# EAGLE design CanSat gpskortuten jtag (EAGLE 5.05)
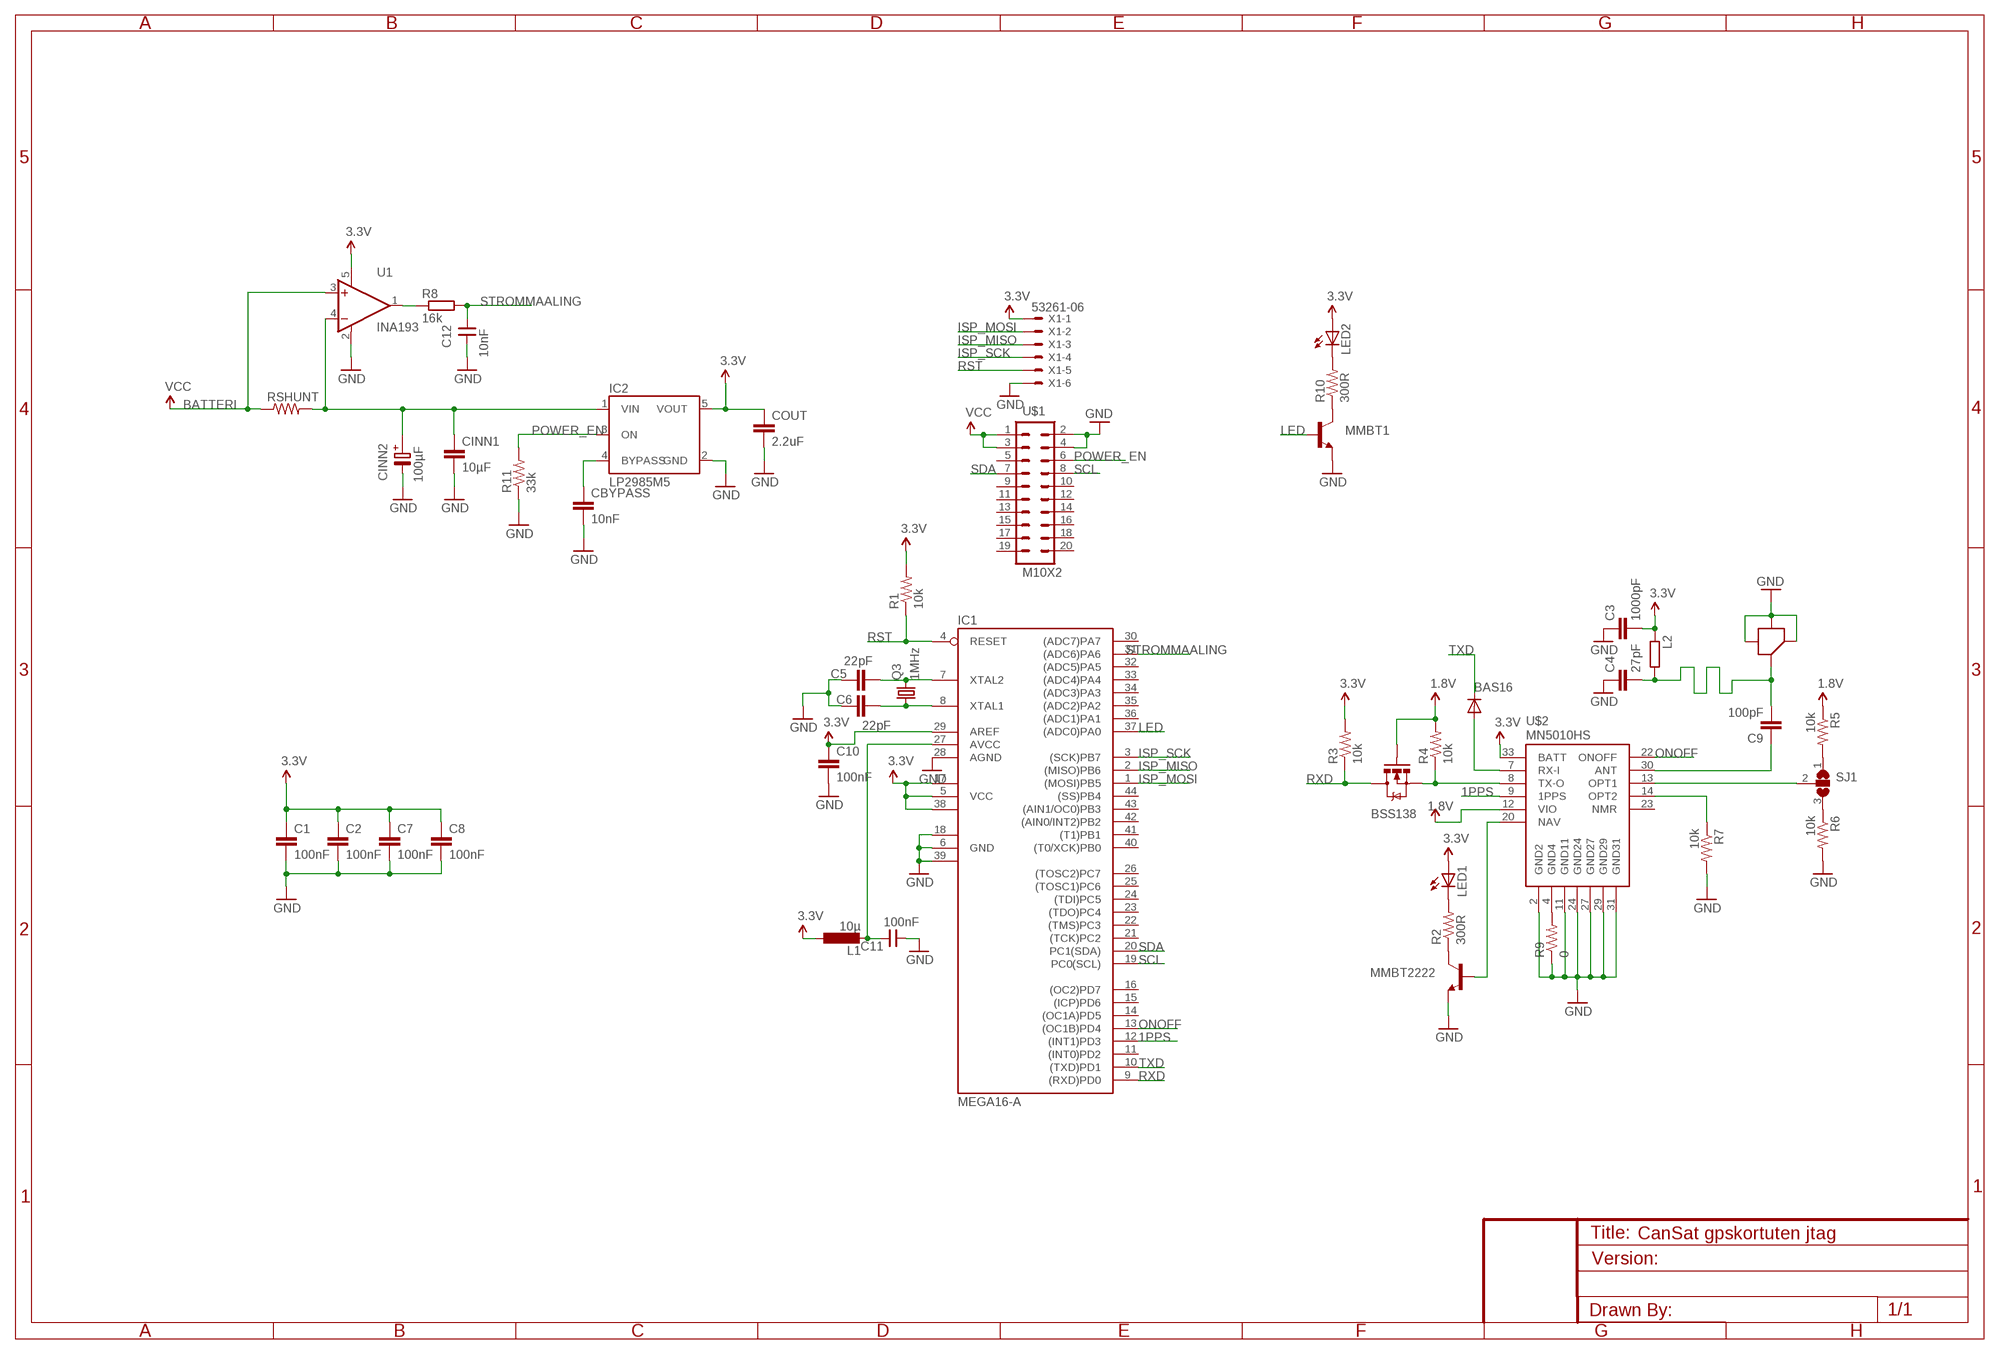
[diagram p0: schematic, sheet 1]

## Parts
BAS16  DIODESOT23  [SOT23-3]
BSS138  MOSFET-NCHANNELSMD  [SOT23-3]
C1  100nF  CAP0805  [0805]
C2  100nF  CAP0805  [0805]
C3  1000pF  C-EUC0402  [C0402]
C4  27pF  C-EUC0402  [C0402]
C5  22pF  CAP0805  [0805]
C6  22pF  CAP0805  [0805]
C7  100nF  CAP0805  [0805]
C8  100nF  CAP0805  [0805]
C9  100pF  C-EUC0603  [C0603]
C10  100nF  CAP0805  [0805]
C11  100nF  CNP-0805  [0805]
C12  10nF  CNP-0805  [0805]
CBYPASS  10nF  CAP0805  [0805]
CINN1  10µF  CAP0805  [0805]
CINN2  100µF  C-PR-SMD-SV-C  [SV-C]
COUT  2.2uF  CAP0805  [0805]
IC1  MEGA16-A  [TQFP44]
IC2  LP2985M5  [SOT23-5]
L1  10µ  L-EUL0805  [L0805]
L2  R-EU_R0603  [R0603]
LED1  LEDCHIPLED_0805  [CHIPLED_0805]
LED2  LEDCHIPLED_0805  [CHIPLED_0805]
MMBT1  TRANSISTOR_NPNSOT23  [SOT23]
MMBT2222  TRANSISTOR_NPNSOT23  [SOT23]
Q3  1MHz  CRYSTALSMD  [HC49UP]
R1  10k  RESISTOR  [0805]
R2  300R  RESISTOR  [0805]
R3  10k  RESISTOR  [0805]
R4  10k  RESISTOR  [0805]
R5  10k  RESISTOR  [0805]
R6  10k  RESISTOR  [0805]
R7  10k  RESISTOR  [0805]
R8  16k  R-EU_R0805  [R0805]
R9  0  RESISTOR  [0805]
R10  300R  RESISTOR  [0805]
R11  33k  RESISTOR  [0805]
RSHUNT  RESISTOR1206  [1206]
SJ1  SOLDERJUMPER_2WAYT  [SJ_2]
U1  INA193  [SOT23-5]
U$1  M10X2  [2X10]
U$2  MN5010HS  [GR-10]
U$3  H.FL_CON  [HFL_FP]
X1  53261-06  [53261-06]

## Nets
1.8V: BSS138.1(G) R4.2 R5.1 U$2.12(VIO)
1PPS: IC1.12((INT1)PD3) U$2.9(1PPS)
3.3V: C1.1 C2.1 C3.2 C7.1 C8.1 C10.1 COUT.1 IC1.5(VCC) IC1.17(VCC1) IC1.29(AREF) IC1.38(VCC2) IC2.5(VOUT) L1.1 L2.1 LED1.A LED2.A R1.2 R3.2 U1.5(V+) U$2.33(BATT) X1.1
ANTENNE: C4.2 C9.2 L2.2 U$3.MIDDLE(SIG)
AVCC: C11.2 IC1.27(AVCC) L1.2
BATTERI: RSHUNT.1 U1.3(VIN+) U$1.1 U$1.3 ; supply symbol labelled VCC
GND: C1.2 C2.2 C3.1 C4.1 C5.1 C6.2 C7.2 C8.2 C10.2 C11.1 C12.1 CBYPASS.2 CINN1.2 CINN2.- COUT.2 IC1.6(GND) IC1.18(GND1) IC1.28(AGND) IC1.39(GND2) IC2.2(GND) MMBT1.2(E) MMBT2222.2(E) R6.2 R7.2 R9.1 R11.1 U1.2(GND) U$1.2 U$1.4 U$2.2(GND2) U$2.11(GND11) U$2.24(GND24) U$2.27(GND27) U$2.29(GND29) U$2.31(GND31) U$3.GND_BOTTOM(GND_B) U$3.GND_LEFT(GND_L) U$3.GND_RIGHT(GND_R) X1.6
ISP_MISO: IC1.2((MISO)PB6) X1.3
ISP_MOSI: IC1.1((MOSI)PB5) X1.2
ISP_SCK: IC1.3((SCK)PB7) X1.4
LED: IC1.37((ADC0)PA0) MMBT1.1(B)
N$2: R5.2 SJ1.1
N$3: R6.1 SJ1.3
N$4: R8.1 U1.1(OUT)
N$5: C9.1 U$2.30(ANT)
N$6: SJ1.2 U$2.13(OPT1)
N$7: R7.1 U$2.14(OPT2)
N$9: BSS138.2(S) R4.1 U$2.8(TX-O)
N$10: C5.2 IC1.7(XTAL2) Q3.2
N$11: C6.1 IC1.8(XTAL1) Q3.1
N$12: LED1.C R2.2
N$13: MMBT2222.3(C) R2.1
N$14: MMBT2222.1(B) U$2.20(NAV)
N$15: R9.2 U$2.4(GND4)
N$16: LED2.C R10.2
N$17: BAS16.1(A) U$2.7(RX-I)
N$18: MMBT1.3(C) R10.1
N$20: CINN1.1 CINN2.+ IC2.1(VIN) RSHUNT.2 U1.4(VIN-)
N$22: CBYPASS.1 IC2.4(BYPASS)
ONOFF: IC1.13((OC1B)PD4) U$2.22(ONOFF)
POWER_EN: IC2.3(ON) R11.2 U$1.6
RST: IC1.4(RESET) R1.1 X1.5
RXD: BSS138.3(D) IC1.9((RXD)PD0) R3.1
SCL: IC1.19(PC0(SCL)) U$1.8
SDA: IC1.20(PC1(SDA)) U$1.7
STROMMAALING: C12.2 IC1.31((ADC6)PA6) R8.2
TXD: BAS16.3(C) IC1.10((TXD)PD1)
Unconnected: IC1.11((INT0)PD2) IC1.14((OC1A)PD5) IC1.15((ICP)PD6) IC1.16((OC2)PD7) IC1.21((TCK)PC2) IC1.22((TMS)PC3) IC1.23((TDO)PC4) IC1.24((TDI)PC5) IC1.25((TOSC1)PC6) IC1.26((TOSC2)PC7) IC1.30((ADC7)PA7) IC1.32((ADC5)PA5) IC1.33((ADC4)PA4) IC1.34((ADC3)PA3) IC1.35((ADC2)PA2) IC1.36((ADC1)PA1) IC1.40((T0/XCK)PB0) IC1.41((T1)PB1) IC1.42((AIN0/INT2)PB2) IC1.43((AIN1/OC0)PB3) IC1.44((SS)PB4) U$1.5 U$1.9 U$1.10 U$1.11 U$1.12 U$1.13 U$1.14 U$1.15 U$1.16 U$1.17 U$1.18 U$1.19 U$1.20 U$2.23(NMR)

## Library data of the parts
BAS16 = SparkFun:DIODE: Diode These are standard reverse protection diodes and small signal diodes. SMA package can handle up to about 1A. SOD-323 can handle about 200mA. What the SOD-323 package when ordering, there are some mfgs out there that are 5-pin packages.
BSS138 = SparkFun:MOSFET-NCHANNEL
C1 C2 C5-C8 C10 CBYPASS CINN1 COUT = SparkFun:CAP: Capacitor Standard 0603 ceramic capacitor, and 0.1" leaded capacitor.
C3 C4 C9 = resistor:C-EU: CAPACITOR, European symbol
C11 C12 = cap-master:CNP-: NON-POLARIZED CAP
CINN2 = cap-pan40:C-PR: POLARIZED ELECTROLYTIC/TANTALUM
IC1 = avr:MEGA16: MICROCONTROLLER 16 Kbytes FLASH 1 kbytes SRAM 512 bytes EEPROM USART 8-channel 10 bit ADC
IC2 = v-reg-3:LP2985: National Semiconductor <http://www.national.com> Micropower Linear Regulator 150mA regulated output, Vin 16V max., ultra-low dropout of 300mV @ 150mA, 1µA standby current, low noise
L1 = rcl-2:L-EU: INDUCTOR, European symbol
L2 R8 = resistor:R-EU_: RESISTOR, European symbol
LED1 LED2 = led:LED: LED OSRAM: - CHIPLED LG R971, LG N971, LY N971, LG Q971, LY Q971, LO R971, LY R971 LH N974, LH R974 LS Q976, LO Q976, LY Q976 LO Q996 - Hyper CHIPLED LW Q18S LB Q993, LB Q99A, LB R99A - SideLED LS A670, LO A670, LY A670, LG A670, LP A670 LB A673, LV A673, LT A673, LW A673 LH A674 LY A675 LS A676, LA A676, LO A676, LY A676, LW A676 LS A679, LY A679, LG A679 - Hyper Micro SIDELED® LS Y876, LA Y876, LO Y876, LY Y876 LT Y87S - SmartLED LW L88C, LW L88S LB L89C, LB L89S, LG L890 LS L89K, LO L89K, LY L89K LS L896, LA L896, LO L896, LY L896 - TOPLED LS T670, LO T670, LY T670, LG T670, LP T670 LSG T670, LSP T670, LSY T670, LOP T670, LYG T670 LG T671, LOG T671, LSG T671 LB T673, LV T673, LT T673, LW T673 LH T674 LS T676, LA T676, LO T676, LY T676, LB T676, LH T676, LSB T676, LW T676 LB T67C, LV T67C, LT T67C, LS T67K, LO T67K, LY T67K, LW E67C LS E67B, LA E67B, LO E67B, LY E67B, LB E67C, LV E67C, LT E67C LW T67C LS T679, LY T679, LG T679 LS T770, LO T770, LY T770, LG T770, LP T770 LB T773, LV T773, LT T773, LW T773 LH T774 LS E675, LA E675, LY E675, LS T675 LS T776, LA T776, LO T776, LY T776, LB T776 LHGB T686 LT T68C, LB T68C - Hyper Mini TOPLED® LB M676 - Mini TOPLED Santana® LG M470 LS M47K, LO M47K, LY M47K Source: http://www.osram.convergy.de LUXEON: - LUMILED® LXK2-PW12-R00, LXK2-PW12-S00, LXK2-PW14-U00, LXK2-PW14-V00 LXK2-PM12-R00, LXK2-PM12-S00, LXK2-PM14-U00 LXK2-PE12-Q00, LXK2-PE12-R00, LXK2-PE12-S00, LXK2-PE14-T00, LXK2-PE14-U00 LXK2-PB12-K00, LXK2-PB12-L00, LXK2-PB12-M00, LXK2-PB14-N00, LXK2-PB14-P00, LXK2-PB14-Q00 LXK2-PR12-L00, LXK2-PR12-M00, LXK2-PR14-Q00, LXK2-PR14-R00 LXK2-PD12-Q00, LXK2-PD12-R00, LXK2-PD12-S00 LXK2-PH12-R00, LXK2-PH12-S00 LXK2-PL12-P00, LXK2-PL12-Q00, LXK2-PL12-R00 Source: www.luxeon.com KINGBRIGHT: KA-3528ASYC Source: www.kingbright.com
MMBT1 MMBT2222 = SparkFun:TRANSISTOR_NPN: Transistor NPN BJT configuration in SOT23 package. MMBT2222 is the common NPN we use. Double check BCE configuration again layout.
Q3 = SparkFun:CRYSTAL: Crystals Various standard crystals. Proven footprints. Spark Fun Electronics SKU : COM-00534
R1-R7 R9-R11 RSHUNT = SparkFun:RESISTOR: Resistor Basic schematic elements and footprints for 0603, 1206, and PTH 1/10th watt (small) resistors.
SJ1 = SparkFun:SOLDERJUMPER_2WAY: Solder Jumper 2 way solder jumper
U1 = burr-brown:INA193
U$1 = SparkFun:M10X2: This was SPECIALLY designed to be used with our Graphic LCD Backpack. Be sure you want to use this! It is not only staggered on each line of header holes, but IT IS ALSO offset of the center point of the top and bottom lines by 5 mil. This causes the headers to lock into place on the "standard" footprint on the LCD screen. The extra squares on the tdocu layer are there simply to reference other pins (if you were to actually populate a longer header than ten long - this is what we do with the backpacks).
U$2 = SparkFun:MN5010HS: MN5010HS GPS Receiver Module. Packagse GR-10 and MN5010HS are NOT tested with this device.
U$3 = hfl:H.FL_CON
X1 = con-molex:53?-06: CONNECTOR wire to board 1.25 mm (.049 inch) pitch header

## Net classes
1 jord: clearance 0.6 mm

## Board
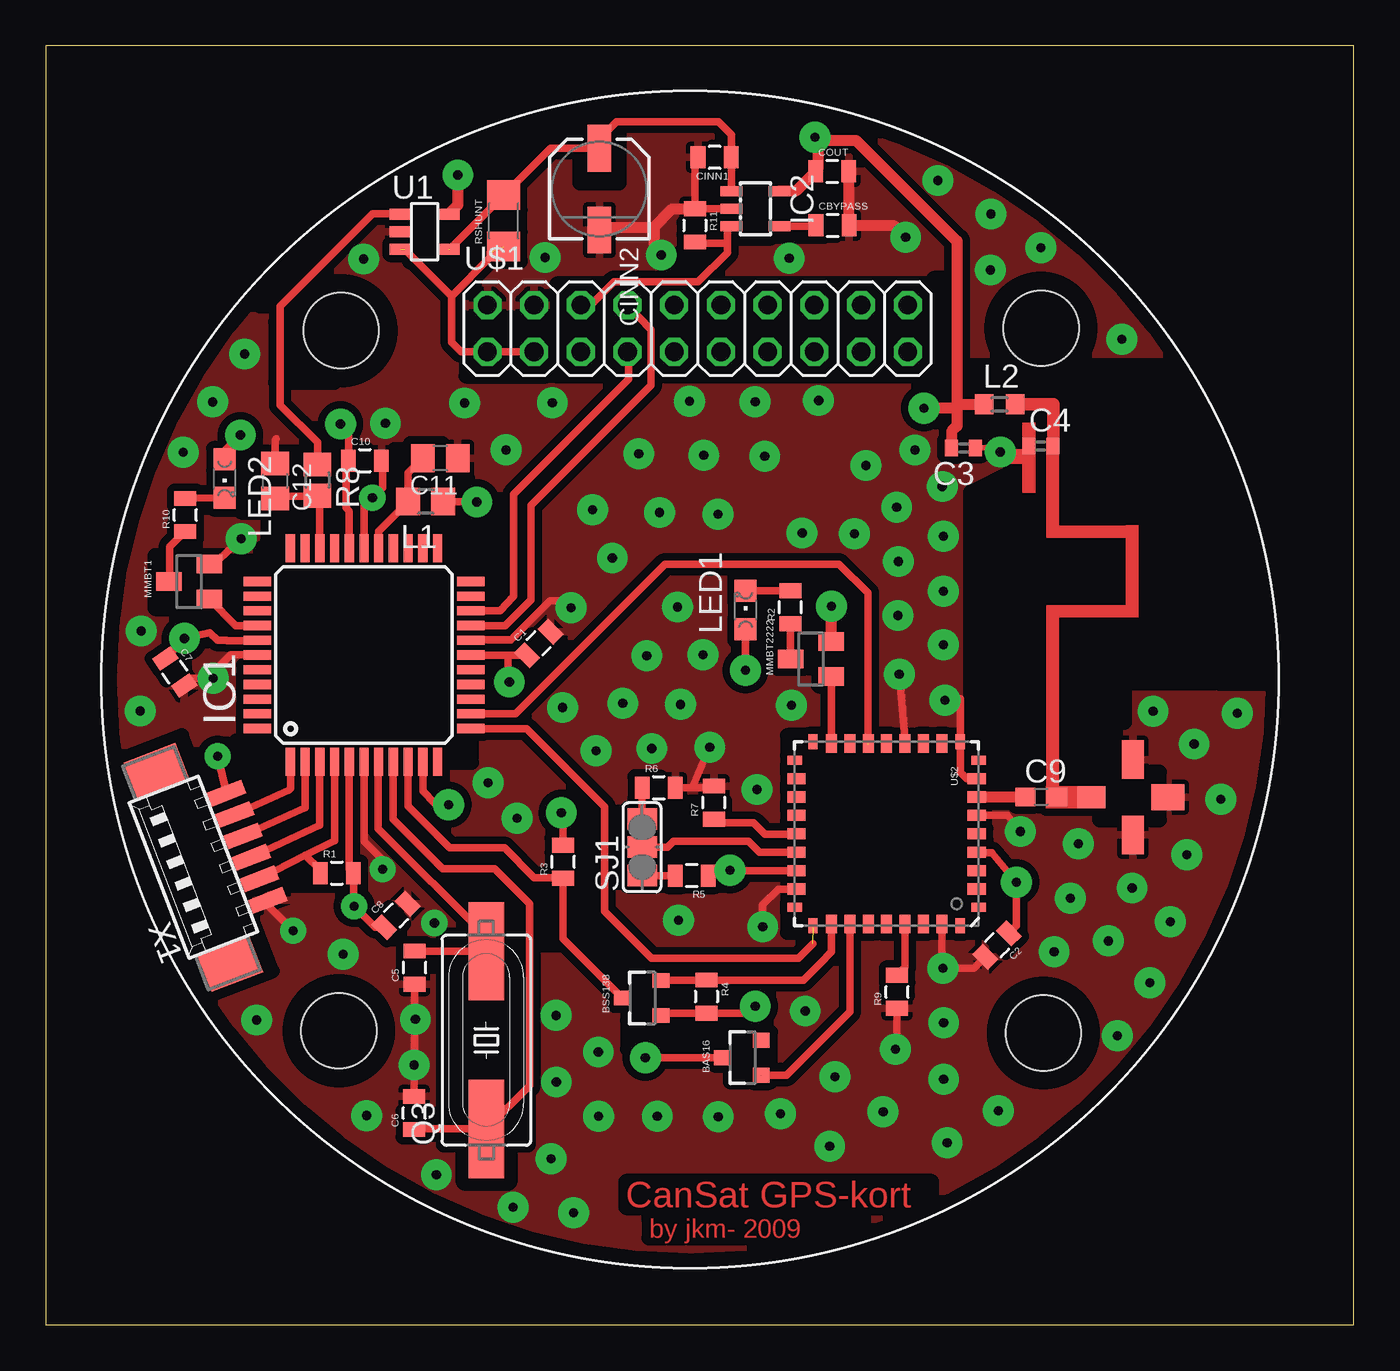
[diagram p1: board, top side]
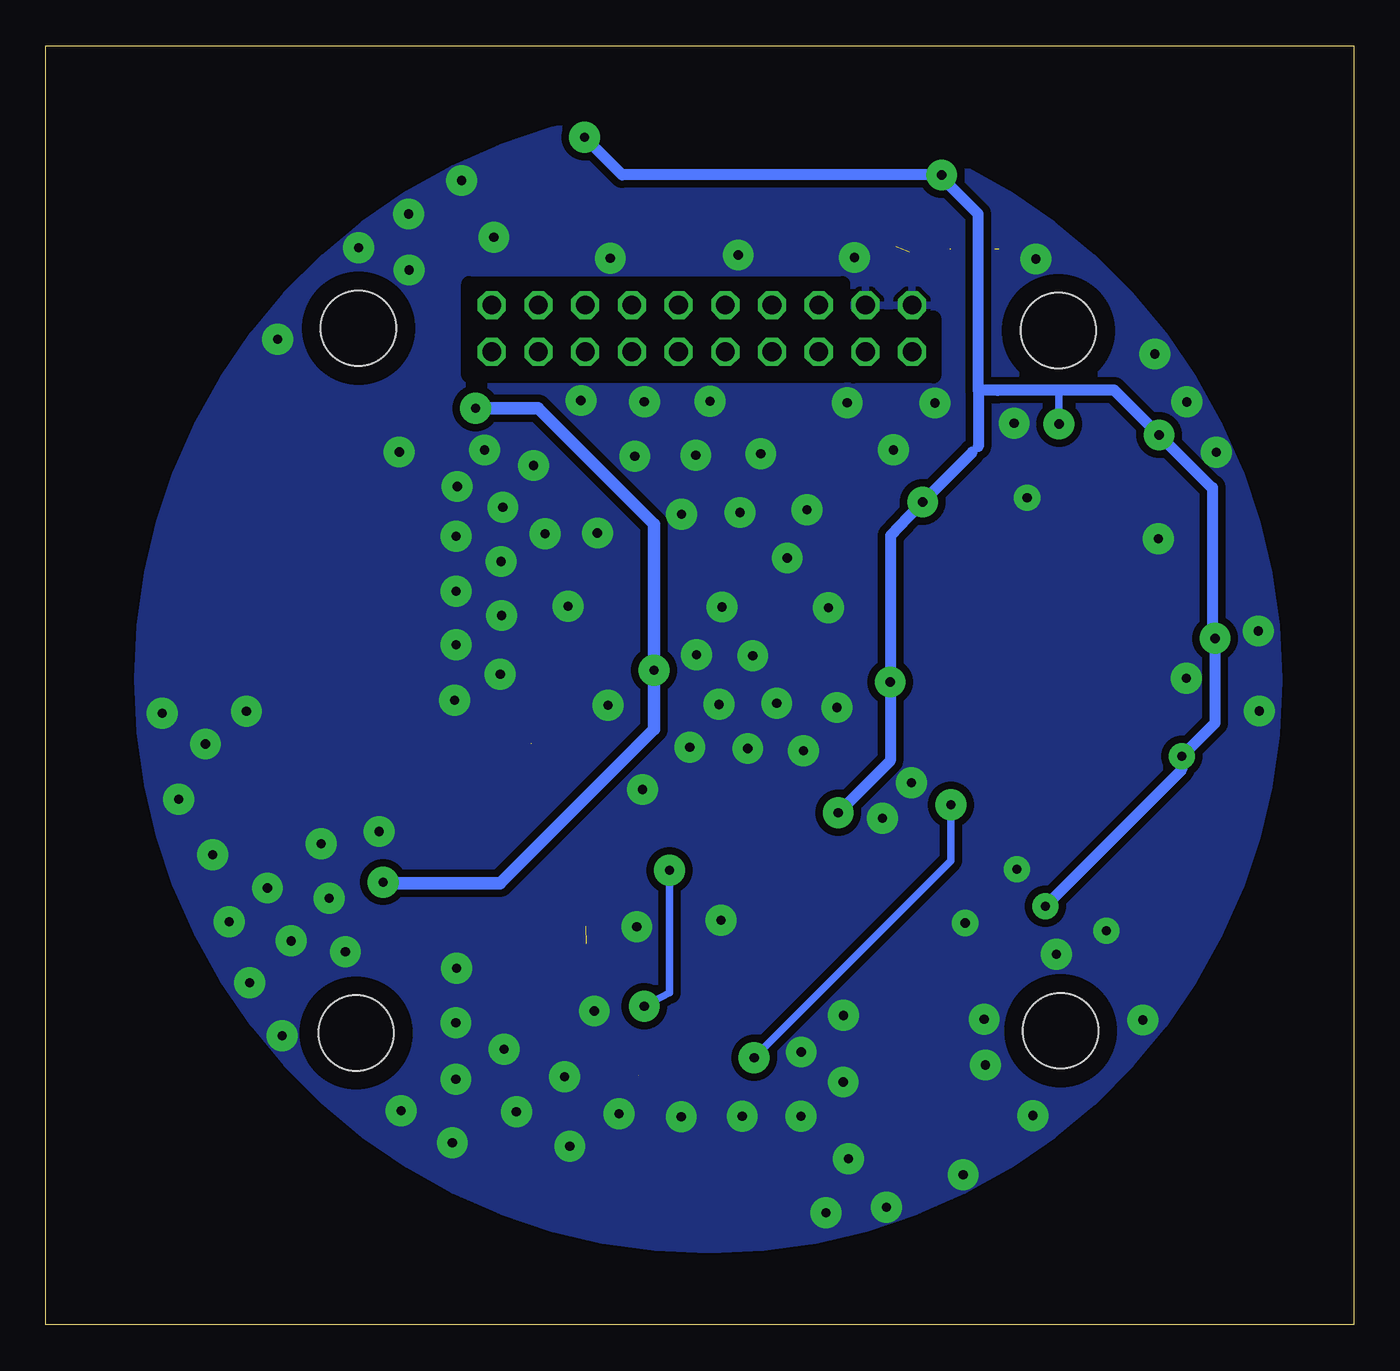
[diagram p2: board, bottom side, seen from below]

Size 71.1 x 69.51 mm. Coordinates in mm from the lower left corner, seen from the top.
Outline: 0,0 71.1,0 71.1,69.51 0,69.51 0,0
Copper layers (1*16): Top 0.035mm / dielectric 1.5mm / Bottom 0.035mm
Design rules "default *": minimum track width 10mil, minimum drill 24mil, track to track 12mil, track to pad 12mil, pad to pad 12mil, via to via 12mil, smd to smd 12mil, copper to edge 40mil, drill to drill 8mil, minimum pad ring 10mil, minimum via ring 8mil, stop-mask expansion 4mil, vias tented up to drill 0mil, thermal gap 10mil
tRestrict: area 35.7,27.1 to 36.9,28.5; area 32,28.6 to 33.4,29.8; area 33.8,23.9 to 36.4,25; area 31.7,16.3 to 34,19.2; area 33.4,26.6 to 35.6,28.4; area 45.7,17.9 to 46.8,19.4; area 37.2,13.2 to 39.4,15.9; area 41,36.4 to 42,37.8; area 42,34.7 to 43.4,36.3; area 21.6,9.8 to 26.2,21.2; area 19.4,10.2 to 20.6,11.6; area 19.4,19.3 to 20.6,20.7; 99 more areas; 35 lines
bRestrict: area 24.6,53.5 to 26.1,54.8; area 27.8,51.6 to 48.1,56.6; area 22.8,51.6 to 27.2,54.7

### Footprints (pad centres in the part's own frame; a part is rotated, then mirrored left to right if it is on the bottom)
SOT23-3 = smd 0.8 x 0.9: 1 -0.95,-1; 2 0.95,-1; 3 0,1.1
0805 = smd 0.8 x 1.2: 1 -0.9,0; 2 0.9,0
C0402 = smd 0.7 x 0.9: 1 -0.65,0; 2 0.65,0
C0603 = smd 1.1 x 1: 1 -0.85,0; 2 0.85,0
0805' = smd 1.27 x 1.524: 1 -0.953,0; 2 0.953,0
SV-C = smd 2.54 x 1.27: + -2.223,0; - 2.223,0
TQFP44 = smd 1.5 x 0.5: 1 -5.8,4; 2 -5.8,3.2; 3 -5.8,2.4; 4 -5.8,1.6; 5 -5.8,0.8; 6 -5.8,0; 7 -5.8,-0.8; 8 -5.8,-1.6; 9 -5.8,-2.4; 10 -5.8,-3.2; 11 -5.8,-4; 23 5.8,-4; 24 5.8,-3.2; 25 5.8,-2.4; 26 5.8,-1.6; 27 5.8,-0.8; 28 5.8,0; 29 5.8,0.8; 30 5.8,1.6; 31 5.8,2.4; 32 5.8,3.2; 33 5.8,4 | smd 0.5 x 1.5: 12 -4,-5.8; 13 -3.2,-5.8; 14 -2.4,-5.8; 15 -1.6,-5.8; 16 -0.8,-5.8; 17 0,-5.8; 18 0.8,-5.8; 19 1.6,-5.8; 20 2.4,-5.8; 21 3.2,-5.8; 22 4,-5.8; 34 4,5.8; 35 3.2,5.8; 36 2.4,5.8; 37 1.6,5.8; 38 0.8,5.8; 39 0,5.8; 40 -0.8,5.8; 41 -1.6,5.8; 42 -2.4,5.8; 43 -3.2,5.8; 44 -4,5.8
SOT23-5 = smd 0.55 x 1.2: 1 -0.95,-1.3; 2 0,-1.3; 3 0.95,-1.3; 4 0.95,1.3; 5 -0.95,1.3
L0805 = smd 1.3 x 1.5: 1 -0.95,0; 2 0.95,0
R0603 = smd 1 x 1.1: 1 -0.85,0; 2 0.85,0
CHIPLED_0805 = smd 1.2 x 1.2: A 0,-1.05; C 0,1.05
SOT23 = smd 1 x 1.4: 1 -0.95,-1.1; 2 0.95,-1.1; 3 0,1.1
HC49UP = smd 5.334 x 1.93: 1 -4.826,0; 2 4.826,0
R0805 = smd 1.3 x 1.5: 1 -0.85,0; 2 0.85,0
1206 = smd 1.6 x 1.8: 1 -1.4,0; 2 1.4,0
SJ_2 = smd 1.168 x 1.6: 1 -1.524,0; 2 0,0; 3 1.524,0
SOT23-5@1 = smd 0.6 x 1.2: 1 -0.95,-1.306; 2 0,-1.306; 3 0.95,-1.306; 4 0.95,1.306; 5 -0.95,1.306
2X10 = drill 1.016 octagon: 1 -11.013,-7.687; 2 -11.013,-5.147; 3 -8.473,-7.687; 4 -8.473,-5.147; 5 -5.933,-7.687; 6 -5.933,-5.147; 7 -3.393,-7.687; 8 -3.393,-5.147; 9 -0.853,-7.687; 10 -0.853,-5.147; 11 1.687,-7.687; 12 1.687,-5.147; 13 4.227,-7.687; 14 4.227,-5.147; 15 6.767,-7.687; 16 6.767,-5.147; 17 9.307,-7.687; 18 9.307,-5.147; 19 11.847,-7.687; 20 11.847,-5.147 | hole 4.1: 19.093,-6.407; 19.22,-44.715; -19.087,-44.591; -18.964,-6.533
GR-10 = smd 0.8 x 0.5: 1 5,4; 9 5,-4; 19 -5,-4; 27 -5,4 | smd 1 x 0.6: 2 4.9,3; 3 4.9,2; 4 4.9,1; 5 4.9,0; 6 4.9,-1; 7 4.9,-2; 8 4.9,-3; 20 -4.9,-3; 21 -4.9,-2; 22 -4.9,-1; 23 -4.9,0; 24 -4.9,1; 25 -4.9,2; 26 -4.9,3 | smd 0.5 x 0.8: 10 4,-5; 18 -4,-5; 28 -4,5; 36 4,5 | smd 0.6 x 1: 11 3,-4.9; 12 2,-4.9; 13 1,-4.9; 14 0,-4.9; 15 -1,-4.9; 16 -2,-4.9; 17 -3,-4.9; 29 -3,4.9; 30 -2,4.9; 31 -1,4.9; 32 0,4.9; 33 1,4.9; 34 2,4.9; 35 3,4.9
HFL_FP = smd 1.4 x 1.8: GND_BOTTOM 0,-1.9 | smd 2.1 x 1.2: GND_LEFT -2.05,0; GND_RIGHT 2.05,0 | smd 1.2 x 1.5: MIDDLE 0,2.25
53261-06 = smd 0.8 x 2: 1 3.125,-2.5; 2 1.875,-2.5; 3 0.625,-2.5; 4 -0.625,-2.5; 5 -1.875,-2.5; 6 -3.125,-2.5 | smd 2.1 x 3: S1 5.625,0.625; S2 -5.625,0.625

### Placement (x,y rotation side)
BAS16  37.88,14.52 90 top
BSS138  32.44,17.76 90 top
C1  26.79,37.04 45 top
C2  51.72,20.64 225 top
C3  49.89,47.66 180 top
C4  54.09,47.77 0 top
C5  20.04,19.41 90 top
C6  20.02,11.51 90 top
C7  7,35.49 305 top
C8  19.03,22.25 45 top
C9  54.1,28.7 0 top
C10  17.34,46.98 0 top
C11  100nF  [0805']  21.44,47.1 180 top
C12  10nF  [0805']  12.45,45.87 270 top
CBYPASS  42.77,59.76 0 top
CINN1  36.35,63.45 180 top
CINN2  30.09,61.73 270 top
COUT  42.75,62.69 0 top
IC1  17.29,36.41 90 top
IC2  38.57,60.67 270 top
L1  20.65,44.74 180 top
L2  51.85,50.03 0 top
LED1  38.04,38.85 0 top
LED2  9.72,46 180 top
MMBT1  7.79,40.4 90 top
MMBT2222  41.6,36.19 90 top
Q3  23.94,15.47 90 top
R1  15.81,24.55 0 top
R2  40.48,39 90 top
R3  28.12,25.17 90 top
R4  35.91,17.84 270 top
R5  35.11,24.42 180 top
R6  33.32,29.19 0 top
R7  36.31,28.39 90 top
R8  14.76,45.91 270 top
R9  46.27,18.1 90 top
R10  7.57,44.02 90 top
R11  35.28,59.76 270 top
RSHUNT  24.88,60 90 top
SJ1  32.41,25.96 90 top
U1  INA193  [SOT23-5@1]  20.59,59.41 270 top
U$1  35.01,60.57 0 top
U$2  45.71,26.69 270 top
U$3  59.09,28.68 90 top
X1  8.6,25.09 111 top

### Tracks (layer width: path | path; a pad name or v marks a point on that pad's centre or on a via)
1.8V  (via drill 0.5 pad 1.68)
  Top 0.406: U$2.12 37.84,24.69 v37.19,24.71 | v38.56,17.31 38.47,17.31 38.11,16.95 R4.2 33.57,16.94 BSS138.1 | v37.19,24.71 37.33,24.74 | v37.19,24.71 36.3,24.71 R5.1
  Bottom 0.406: v37.19,24.71 37.19,18.06 v38.56,17.31
1PPS  (1 unrouted)
  Top 0.406: IC1.12 26.14,32.41 30.38,28.17 30.38,22.47 32.92,19.93 40.92,19.93 41.71,20.72 | U$2.9 41.72,21.68
3.3V  (via drill 0.5 pad 1.42, 0.5 pad 1.68)
  Top 0.406: 50.64,25.66 U$2.33 50.65,25.65 51.44,25.65 v52.77,24.07 52.77,21.69 C2.1 | IC1.38 11.48,37.19 9.84,37.19 9.84,37.2 9.33,37.2 8.91,37.62 v7.53,37.31 7.52,37.26 C7.1 | IC1.5 | IC1.17 25.13,36.4 | IC1.5 16.5,30.61 | X1.1 v9.34,30.9 | IC1.5 16.49,24.78 R1.2 v16.75,22.76 17.9,21.61 C8.1 | LED1.A 38.03,37.79 v38.03,35.57 | R3.2 28.12,27.73 v28.02,27.83 | 25.13,36.4 C1.1 | v25.19,34.94 25.13,35 25.13,36.4 | LED2.A 9.72,47.51 v10.57,48.36 | IC1.29 16.49,44.22 16.31,44.4 16.31,46.85 C10.1 16.44,48.53 v16.01,48.96 | L1.1 23.41,44.74 v23.43,44.72
  Top 0.61: IC2.5 40.78,61.62 COUT.1 41.97,62.81 41.97,64.39 | U1.5 22.39,60.86 v22.39,62.5 | v41.81,64.54 41.97,64.39 | 41.97,64.39 44.05,64.39 49.53,58.91 49.53,49.99 | 49.53,49.99 49.53,49.77 | C3.2 49.24,48.57 49.54,48.87 49.54,49.76 49.53,49.77 | L2.1 49.57,50.03 49.53,49.99 | v47.74,49.81 49.49,49.81 49.53,49.77
  Bottom 0.406: 22.89,45.27 20.73,47.43 20.72,47.43 | 20.72,47.43 20.73,47.44 | 20.72,47.43 20.71,47.42 | 20.41,47.74 20.72,47.43 | 22.39,62.36 v22.39,62.5 | 19.34,50.8 19.35,50.8 | 7.65,45.51 7.71,45.51 | v10.57,48.36 | v10.57,48.36 10.82,48.62 | v16.01,48.96 16.01,50.68 16.14,50.8
  Bottom 0.61: 20.73,47.44 21.95,46.2 v23.43,44.72 23.74,44.41 25.18,42.9 25.18,34.96 v25.19,34.94 25.19,30.66 v28.02,27.83 | 20.41,50.8 20.41,47.74 | 20.41,50.8 20.41,60.38 22.39,62.36 | 7.65,45.51 7.65,37.92 7.53,37.79 v7.53,37.31 7.52,32.72 v9.34,30.9 9.34,30.17 v16.75,22.76 | 19.34,50.8 16.14,50.8 13.01,50.8 v10.57,48.36 7.71,45.51 | 19.35,50.8 20.41,50.8 | v22.39,62.5 39.77,62.5 v41.81,64.54
  Bottom 0.67: v52.77,24.07 52.72,24.01 46.4,24.01 38.03,32.38 v38.03,35.57 38.03,43.52 44.34,49.83 47.73,49.83 v47.74,49.81
ANTENNE
  Top 0.406: 54.77,47.8 C4.2 54.74,43.15 54.77,43.11 59.08,43.11 59.08,38.79 54.73,38.79 54.73,28.92 C9.2 54.74,28.68 U$3.MIDDLE
  Top 0.67: L2.2 54.77,50.03 54.77,47.81 C4.2
AVCC
  Top 0.406: C11.2 19.7,46.31 L1.2 18.09,43.14 IC1.27
BATTERI  (2 unrouted)
  Top 0.406: 22.05,53.42 22.58,52.89 U$1.1 U$1.3 | 22.05,53.42 22.07,53.42 | 24.14,58.31 24.14,58.01 22.05,55.92 | 22.05,55.92 22.05,53.43 22.05,53.42 | 22.05,55.92 19.51,58.46
GND  (via drill 0.5 pad 1.42, 0.5 pad 1.68)
  Top 0.305: 51.85,47.63 51.85,47.66 C3.1
  Top 0.406: U$2.31 52.27,27.69 v52.98,26.81 | U$2.29 50.63,29.67 50.07,29.67 49.71,30.03 U$2.27 | U$2.27 | U$2.24 46.73,31.61 v46.4,35.36 | U$2.11 39.82,23.69 38.97,22.84 v38.97,21.63 | IC1.18 23.12,37.24 25.27,37.23 25.43,37.37 27.42,39.36 28.91,39.36 v28.55,38.98 | IC1.28 17.31,42.22 17.31,44.51 v17.75,44.95 18.31,45.51 18.31,46.88 | MMBT1.2 9.43,41.6 v10.61,42.73 | 17.28,30.59 IC1.6 17.29,26.28 18.24,25.33 18.24,24.86 v18.31,24.76 | IC1.39 11.47,36.43 10.04,36.43 9.31,35.7 v9.09,35.14 7.91,35.14 C7.2 | R9.1 46.27,15.02 v46.19,14.98 | IC2.2 R11.1 35.28,63.28 CINN1.2 | 33.05,57.93 v33.46,58.15 | CINN2.- 30.25,59.67 | 43.67,62.68 COUT.2 | C6.2 20.02,15.22 v20.01,14.12 20.04,15.34 C5.1 | X1.6 11.83,23.03 v13.43,21.43 | U$2.2 48.71,19.46 v48.78,19.39 50.47,19.39 C2.2 | MMBT2222.2 42.71,37.14 | U$2.27 49.71,34.04 v48.88,33.94 | R6.2 35.18,29.19 | 35.18,29.19 36.22,29.19 R7.2 | v36.09,31.39 35.15,29.23 35.18,29.19 | C3.1 50.53,47.65 50.53,47.63 | 53.43,47.42 C4.1 53.38,47.77 53.38,47.22 | 51.85,47.63 v51.89,47.44 | 51.95,47.04 51.95,47.38 | C12.1 12.45,48.09 12.52,48.16
  Top 0.61: 33.05,59.67 33.05,57.93 | 33.05,59.67 34.04,60.66 R11.1 | 30.25,59.67 33.05,59.67 | v46.74,59.12 46.1,59.76 CBYPASS.2 43.67,62.68 | 42.71,37.14 v42.71,39.05
  Top 0.813: v51.89,47.44 51.89,47.22 53.38,47.22
  other vias: 17.28,57.93 59.06,23.74 63.88,28.57 60.2,33.34 38.67,29.1 40.53,33.68 48.8,36.97 48.8,39.87 62.03,25.54 56.14,26.15 48.79,42.87 47.25,47.55 48.73,45.56 46.32,38.56 36.53,44.06 33.36,44.15 29.72,44.31 32.23,47.34 35.77,47.27 34.99,50.2 42.01,50.24 34.51,33.72 28.08,33.55 32.94,31.32 31.37,33.78 29.91,31.21 34.39,21.98 55.7,23.19 57.77,20.87 27.73,16.82 17.43,11.37 42.91,13.48 11.46,16.57 5.13,33.37 64.77,33.24 27.14,58.01 40.41,57.98 27.53,50.11 22.77,50.11 25.02,47.56 10.8,52.77 48.81,16.42 49,9.89 41.29,17.06 58.49,53.57 54.09,58.55 51.37,60.38 18.46,49.01 24.04,29.46 51.35,57.33 27.75,13.2 27.46,9.02 25.4,6.38 21.23,8.16 20.09,16.61 28.69,6.09 30.03,14.83 46.36,41.49 46.26,44.44 44.58,46.71 43.96,43 41.11,43.04 62.42,31.57 61.13,21.91 60.02,18.6 54.82,20.28 58.25,15.71 48.81,13.35 51.79,11.64 35.73,36.42 32.67,36.36 34.34,39.01 38.56,50.18 39.08,47.2 30.79,41.68 9.06,50.16 5.18,37.71 48.49,62.2 21.12,21.84 45.52,11.59 39.93,11.47 42.61,9.71 36.56,11.31 33.23,11.33 30.05,11.33 16.16,20.15 7.46,47.42 25.61,27.53
  pour Bottom (isolate 0.406): 35.06,66.08 35.18,66.08 arc-90 66.1,35.16 66.1,35.07 arc-90 35.11,4.08 34.95,4.08 arc-90 4.07,34.96 4.07,35.14 arc-90 35.01,66.08
  pour Top (isolate 0.406): 35.09,66.08 35.15,66.08 arc-90 66.12,35.1 66.12,35.01 arc-90 35.19,4.08 34.97,4.08 arc-90 4.07,34.99 4.07,35.13 arc-90 35.02,66.08
ISP_MISO
  Top 0.406: X1.3 14.1,28.1 IC1.2
ISP_MOSI
  Top 0.406: X1.2 13.19,29.06 13.29,29.16 IC1.1
ISP_SCK
  Top 0.406: X1.4 14.89,27.15 IC1.3
LED
  Top 0.406: IC1.37 10.33,38.01 MMBT1.1
N$2
  Top 0.406: R5.2 32.43,24.42 SJ1.1
N$3
  Top 0.406: SJ1.3 R6.1
N$4
  Top 0.406: U1.1 19.26,60.39 17.76,60.39 12.73,55.36 12.73,49.99 14.76,47.97 R8.1
N$5
  Top 0.406: U$2.30
  Top 0.6: U$2.30 C9.1
N$6
  Top 0.406: U$2.13 38.79,25.69 38.19,26.29 34.12,26.29 33.8,25.97 32.42,25.97 SJ1.2
N$7
  Top 0.406: U$2.14 40.79,26.67 39.1,26.67 38.47,27.3 36.5,27.3 R7.1
N$9
  Top 0.406: U$2.8 42.71,20.27 42.08,19.64 42.08,19.62 41.19,18.73 35.92,18.73 R4.1 | R4.1 | R4.1 33.47,18.74 BSS138.2
N$10
  Top 0.406: IC1.7 18.07,30.59 18.07,26.97 23.91,21.14 24.7,18.98 23.38,20.3 | 24.06,20.18 Q3.2 23.38,20.3 | 23.38,20.3 20.06,20.3 C5.2
N$11
  Top 0.406: IC1.8 18.88,27.48 21.57,24.8 24.38,24.8 26.3,22.88 26.3,13.01 Q3.1 20.06,10.65 C6.1
N$12
  Top 0.406: R2.2 LED1.C
N$13
  Top 0.406: MMBT2222.3 40.48,36.19 R2.1
N$14
  Top 0.406: U$2.20 | U$2.20 42.71,31.6 | U$2.20 42.7,31.6 MMBT2222.1
N$15
  Top 0.406: U$2.4 46.71,19.44 R9.2
N$16
  Top 0.406: LED2.C R10.2
N$17  (1 unrouted)
  Top 0.406: U$2.7 43.71,17.01 40.26,13.56 BAS16.1
N$18
  Top 0.406: MMBT1.3 6.74,40.44 6.74,42.29 R10.1
N$20  (1 unrouted)
  Top 0.406: RSHUNT.2 27.43,63.95 CINN2.+ 30.09,64.45 31.03,65.39 36.57,65.39 37.28,64.69 37.28,63.48 CINN1.1 37.27,63.43 IC2.1 | RSHUNT.2 24.66,61.4 | 21.95,58.46 RSHUNT.2
N$22
  Top 0.406: CBYPASS.1 41.82,59.72 IC2.4
ONOFF  (1 unrouted)
  Top 0.406: IC1.13 25.53,33.21 33.67,41.35 43.13,41.35 44.69,39.78 44.69,31.59 | U$2.22 44.73,31.61
POWER_EN
  Top 0.406: IC2.3 37.04,59.49 37.04,58.79 | 37.04,58.79 37.04,58.27 35.47,56.7 30.88,56.7 29.62,55.43 U$1.6 | R11.2 35.35,58.79 37.04,58.79
RST
  Top 0.406: X1.5 14.1,25.54 | IC1.4 15.69,26.31 14.1,25.54 | R1.1 14.91,24.73 14.1,25.54
RXD
  Top 0.406: R3.1 28.14,24.25 | IC1.9 19.69,28.18 21.95,25.92 24.92,25.92 26.55,24.3 28.09,24.3 R3.1 | BSS138.3 28.11,20.99 R3.1
SCL
  Top 0.406: IC1.19 23.12,37.98 23.16,38.02 23.17,38.01 24.96,38.01 26.37,39.41 26.37,44.55 32.9,51.07 32.9,54.1 U$1.8
SDA
  Top 0.406: IC1.20 24.68,38.81 25.43,39.59 25.43,45.14 31.67,51.39 31.67,52.89 U$1.7
STROMMAALING
  Top 0.406: 14.91,42.21 IC1.31 14.89,44.57 R8.2 14.72,45.06 14.7,45.05 12.58,45.05 C12.2
TXD  (via drill 0.5 pad 1.68)
  Top 0.406: IC1.10 20.49,29 21.14,28.36 21.8,28.36 v21.88,28.27 | v32.59,14.51 BAS16.3
  Bottom 0.406: v32.59,14.51 21.88,25.22 v21.88,28.27
(copper drawn outside any net)
  shapes: Top area x7

### Text on the board
Top: CanSat GPS-kort | by jkm- 2009